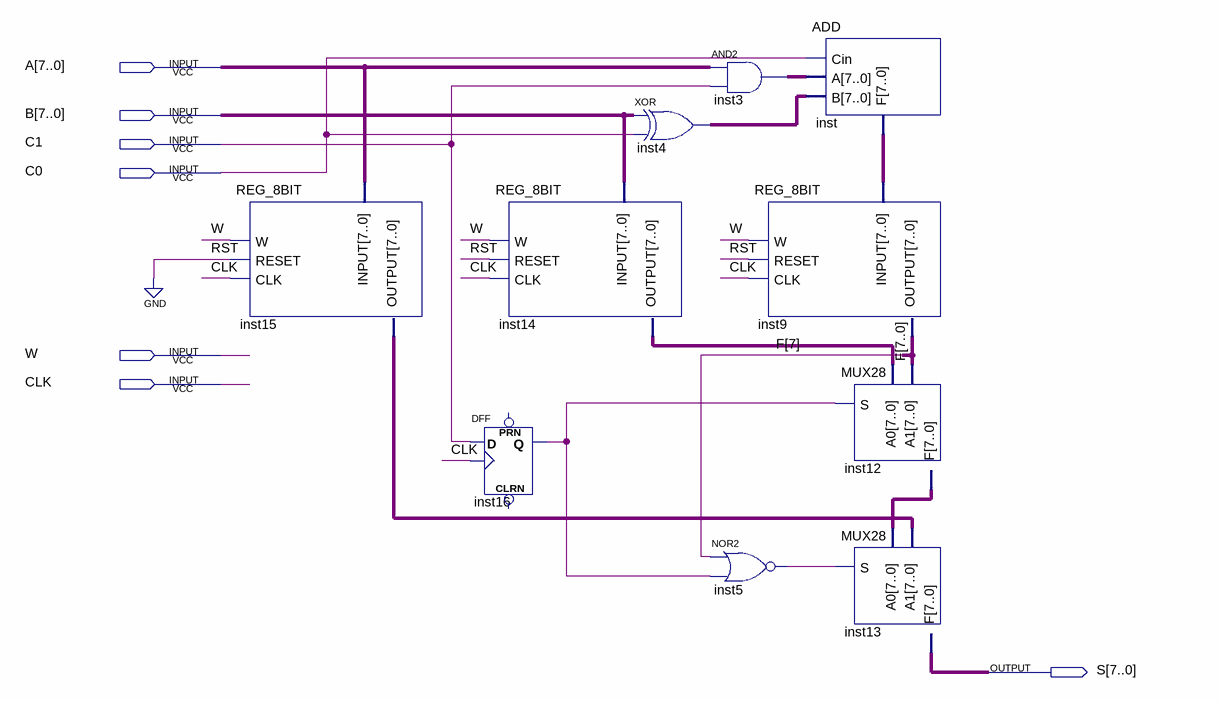
[diagram p0: schematic sheet]
// Quartus schematic ADD_SUB_MAX.bdf as structural Verilog: 10 symbols, 7 pins
module ADD_SUB_MAX (
  input  [7:0] A,
  input  [7:0] B,
  input  C1,
  input  C0,
  input  W,
  input  CLK,
  output [7:0] S
);

  wire inst5_out, inst16_q;
  wire [7:0] F, inst3_out, inst4_out, inst12_f, inst14_output, inst15_output, inst_f;

  REG_8BIT inst15 (.W(W), .INPUT(A), .RESET(1'b0), .CLK(CLK), .OUTPUT(inst15_output));
  REG_8BIT inst14 (.W(W), .INPUT(B), .RESET(1'b0), .CLK(CLK), .OUTPUT(inst14_output));
  DFF inst16 (.CLK(CLK), .D(C1), .Q(inst16_q));  // open: CLRN, PRN
  assign inst4_out = B ^ {8{C0}};  // XOR inst4, 8 bits wide
  assign inst3_out = A & {8{C1}};  // AND2 inst3, 8 bits wide
  nor inst5 (inst5_out, F[7], inst16_q);
  ADD inst (.Cin(C0), .A(inst3_out), .B(inst4_out), .F(inst_f));
  REG_8BIT inst9 (.W(W), .INPUT(inst_f), .RESET(1'b0), .CLK(CLK), .OUTPUT(F));
  MUX28 inst12 (.S(inst16_q), .A0(inst14_output), .A1(F), .F(inst12_f));
  MUX28 inst13 (.S(inst5_out), .A0(inst12_f), .A1(inst15_output), .F(S));
endmodule
